# EAGLE design atmega32u4bb_ASDF (EAGLE 6.4)
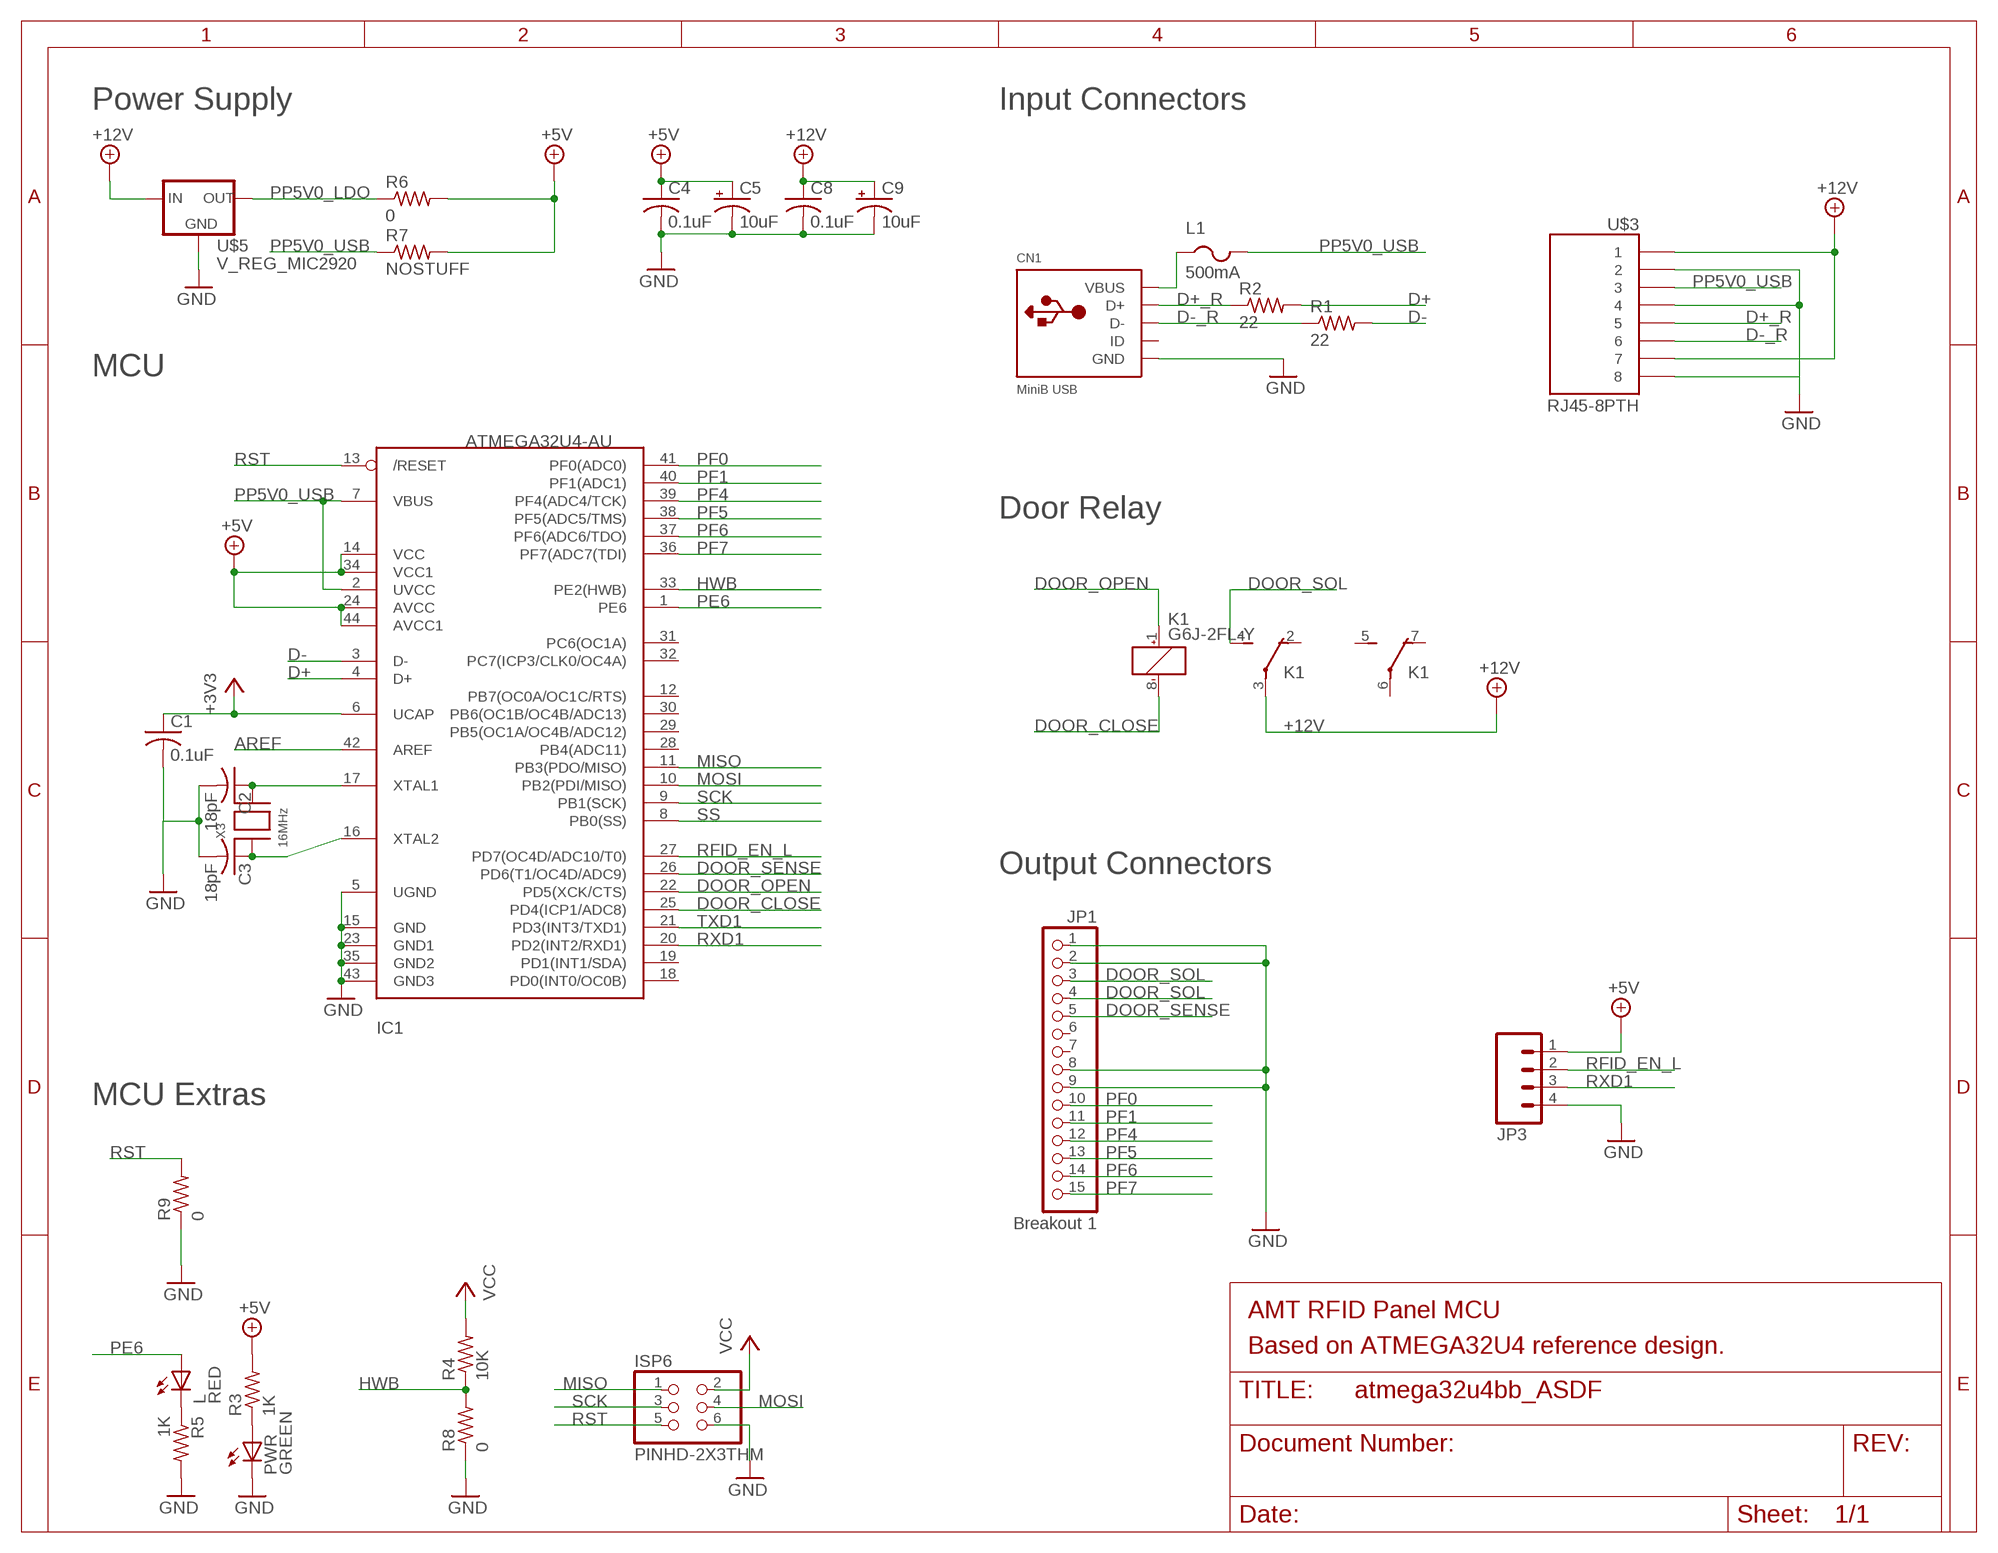
[diagram p0: schematic, sheet 1]

## Parts
C1  0.1uF  C-USC0805K  [C0805K]
C2  18pF  C-USC0805K  [C0805K]
C3  18pF  C-USC0805K  [C0805K]
C4  0.1uF  C-USC0805K  [C0805K]
C5  10uF  CPOL-USA/3216-18R  [A/3216-18R]
C8  0.1uF  C-USC0805K  [C0805K]
C9  10uF  CPOL-USA/3216-18R  [A/3216-18R]
CN1  MiniB USB  USBMINIB  [USB-MINIB]
IC1  ATMEGA32U4-AU  [TQFP44]
ISP6  PINHD-2X3THM  [ISP6]
JP1  Breakout 1  PINHD-1X15-CB  [1X15-CB]
JP3  M04LOCK  [1X04_LOCK]
K1  G6J-2FL-Y  [G6J-2FL-Y]
L  RED  LEDCHIPLED_0805  [CHIPLED_0805]
L1  500mA  PTCFUSE-1206  [R1206]
PWR  GREEN  LEDCHIPLED_0805  [CHIPLED_0805]
R1  22  R-US_R0805  [R0805]
R2  22  R-US_R0805  [R0805]
R3  1K  R-US_R0805  [R0805]
R4  10K  R-US_R0805  [R0805]
R5  1K  R-US_R0805  [R0805]
R6  0  R-US_R0805  [R0805]
R7  NOSTUFF  R-US_R0805  [R0805]
R8  0  R-US_R0805  [R0805]
R9  0  R-US_R0805  [R0805]
U$3  RJ45-8PTH  [RJ45-8]
U$5  V_REG_MIC2920  [SOT223]
X3  16MHz  XTALNX5032  [NX5032]

## Nets
+3V3: C1.1 IC1.6(UCAP)
+5V: C4.1 C5.+ IC1.14(VCC) IC1.24(AVCC) IC1.34(VCC1) IC1.44(AVCC1) JP3.1 R3.2 R6.2 R7.2
+12V: C8.1 C9.+ K1.3(2:P) U$3.1 U$3.7 U$5.1(IN)
AREF: IC1.42(AREF)
D+: IC1.4(D+) R2.2
D+_R: CN1.D+ R2.1 U$3.5
D-: IC1.3(D-) R1.2
D-_R: CN1.D- R1.1 U$3.6
DOOR_CLOSE: IC1.25(PD4(ICP1/ADC8)) K1.8(1:-)
DOOR_OPEN: IC1.22(PD5(XCK/CTS)) K1.1(1:+)
DOOR_SENSE: IC1.26(PD6(T1/OC4D/ADC9)) JP1.5
DOOR_SOL: JP1.3 JP1.4 K1.4(2:S)
GND: C1.2 C2.2 C3.2 C4.2 C5.- C8.2 C9.- CN1.GND IC1.5(UGND) IC1.15(GND) IC1.23(GND1) IC1.35(GND2) IC1.43(GND3) ISP6.6 JP1.1 JP1.2 JP1.8 JP1.9 JP3.4 PWR.C R5.2 R8.1 R9.1 U$3.2 U$3.4 U$3.8 U$5.2(GND)
HWB: IC1.33(PE2(HWB)) R4.1 R8.2
MISO: IC1.11(PB3(PDO/MISO)) ISP6.1
MOSI: IC1.10(PB2(PDI/MISO)) ISP6.4
N$1: PWR.A R3.1
N$8: C2.1 IC1.17(XTAL1) X3.P$2
N$9: C3.1 IC1.16(XTAL2) X3.P$1
N$10: L.C R5.1
PE6: IC1.1(PE6) L.A
PF0: IC1.41(PF0(ADC0)) JP1.10
PF1: IC1.40(PF1(ADC1)) JP1.11
PF4: IC1.39(PF4(ADC4/TCK)) JP1.12
PF5: IC1.38(PF5(ADC5/TMS)) JP1.13
PF6: IC1.37(PF6(ADC6/TDO)) JP1.14
PF7: IC1.36(PF7(ADC7(TDI)) JP1.15
PP5V0_LDO: R6.1 U$5.3(OUT)
PP5V0_USB: IC1.2(UVCC) IC1.7(VBUS) L1.2 R7.1 U$3.3
RFID_EN_L: IC1.27(PD7(OC4D/ADC10/T0)) JP3.2
RST: IC1.13(/RESET) ISP6.5 R9.2
RXD1: IC1.20(PD2(INT2/RXD1)) JP3.3
SCK: IC1.9(PB1(SCK)) ISP6.3
SS: IC1.8(PB0(SS))
TXD1: IC1.21(PD3(INT3/TXD1))
VBUS: CN1.VBUS L1.1
VCC: ISP6.2 R4.2
Unconnected: CN1.ID IC1.12(PB7(OC0A/OC1C/RTS)) IC1.18(PD0(INT0/OC0B)) IC1.19(PD1(INT1/SDA)) IC1.28(PB4(ADC11)) IC1.29(PB5(OC1A/OC4B/ADC12)) IC1.30(PB6(OC1B/OC4B/ADC13)) IC1.31(PC6(OC1A)) IC1.32(PC7(ICP3/CLK0/OC4A)) JP1.6 JP1.7 K1.2(2:O) K1.5(3:S) K1.6(3:P) K1.7(3:O)

## Notes on the sheet
- Power Supply | Input Connectors
- MCU
- Door Relay
- Output Connectors
- MCU Extras
- AMT RFID Panel MCU
- Based on ATMEGA32U4 reference design.

## Library data of the parts
C1-C4 C8 = adafruit:C-US: CAPACITOR, American symbol
C5 C9 = adafruit:CPOL-US: POLARIZED CAPACITOR, American symbol
CN1 = adafruit:USB: USB Connectors USBMINIB - Surface Mount Female Mini-B USB Connector 4UConnector: 06564 By microbuilder.eu Thru-hole RA Female Mini-B USB Connector 4UConnector: 18732 By ladyada.net
IC1 = adaprog:ATMEGA32U4
ISP6 = adaprog:PINHD-2X3
JP1 = adafruit:PINHD-1X15: PIN HEADER
JP3 = SparkFun-Connectors:M04: Header 4 Standard 4-pin 0.1" header. Use with straight break away headers (SKU : PRT-00116), right angle break away headers (PRT-00553), swiss pins (PRT-00743), machine pins (PRT-00117), and female headers (PRT-00115). Molex polarized connector foot print use with SKU : PRT-08231 with associated crimp pins and housings. 1MM SMD Version SKU: PRT-10208
K1 = relay:G6J*-2?-Y: Surface-Mounting Signal Relay - G6J-Y 5.7 x 10.6 x 9 mm Source: http://www.omroncomponents.eu/ .. K125-E2-02-X.pdf; MPN: G6J-2FL-Y-TR DC4.5; OC_FARNELL: 1798618; OC_NEWARK: 04M9907
L PWR = adafruit:LED: LED OSRAM: - CHIPLED LG R971, LG N971, LY N971, LG Q971, LY Q971, LO R971, LY R971 LH N974, LH R974 LS Q976, LO Q976, LY Q976 LO Q996 - Hyper CHIPLED LW Q18S LB Q993, LB Q99A, LB R99A - SideLED LS A670, LO A670, LY A670, LG A670, LP A670 LB A673, LV A673, LT A673, LW A673 LH A674 LY A675 LS A676, LA A676, LO A676, LY A676, LW A676 LS A679, LY A679, LG A679 - Hyper Micro SIDELED® LS Y876, LA Y876, LO Y876, LY Y876 LT Y87S - SmartLED LW L88C, LW L88S LB L89C, LB L89S, LG L890 LS L89K, LO L89K, LY L89K LS L896, LA L896, LO L896, LY L896 - TOPLED LS T670, LO T670, LY T670, LG T670, LP T670 LSG T670, LSP T670, LSY T670, LOP T670, LYG T670 LG T671, LOG T671, LSG T671 LB T673, LV T673, LT T673, LW T673 LH T674 LS T676, LA T676, LO T676, LY T676, LB T676, LH T676, LSB T676, LW T676 LB T67C, LV T67C, LT T67C, LS T67K, LO T67K, LY T67K, LW E67C LS E67B, LA E67B, LO E67B, LY E67B, LB E67C, LV E67C, LT E67C LW T67C LS T679, LY T679, LG T679 LS T770, LO T770, LY T770, LG T770, LP T770 LB T773, LV T773, LT T773, LW T773 LH T774 LS E675, LA E675, LY E675, LS T675 LS T776, LA T776, LO T776, LY T776, LB T776 LHGB T686 LT T68C, LB T68C - Hyper Mini TOPLED® LB M676 - Mini TOPLED Santana® LG M470 LS M47K, LO M47K, LY M47K Source: http://www.osram.convergy.de/
L1 = adafruit:PTCFUSE: PTC fuses, resettable thermistors
R1-R9 = adafruit:R-US_: RESISTOR, American symbol
U$3 = SparkFun-Connectors:RJ45-8: RJ45 Jack Simple RJ45, 8-pin connection - connector for common Cat5, Cat5e, and Cat6 Ethernet cables. Footprint not yet proven in production. Connector sku is PRT-00643; Breakout PCB sku is BOB-00716.
U$5 = SparkFun-PowerIC:V_REG_MIC2920: MIC2920A (http://www.micrel.com/_PDF/mic2920.pdf) - 400mA output LDO Regulator
X3 = adaprog:XTAL

## Board
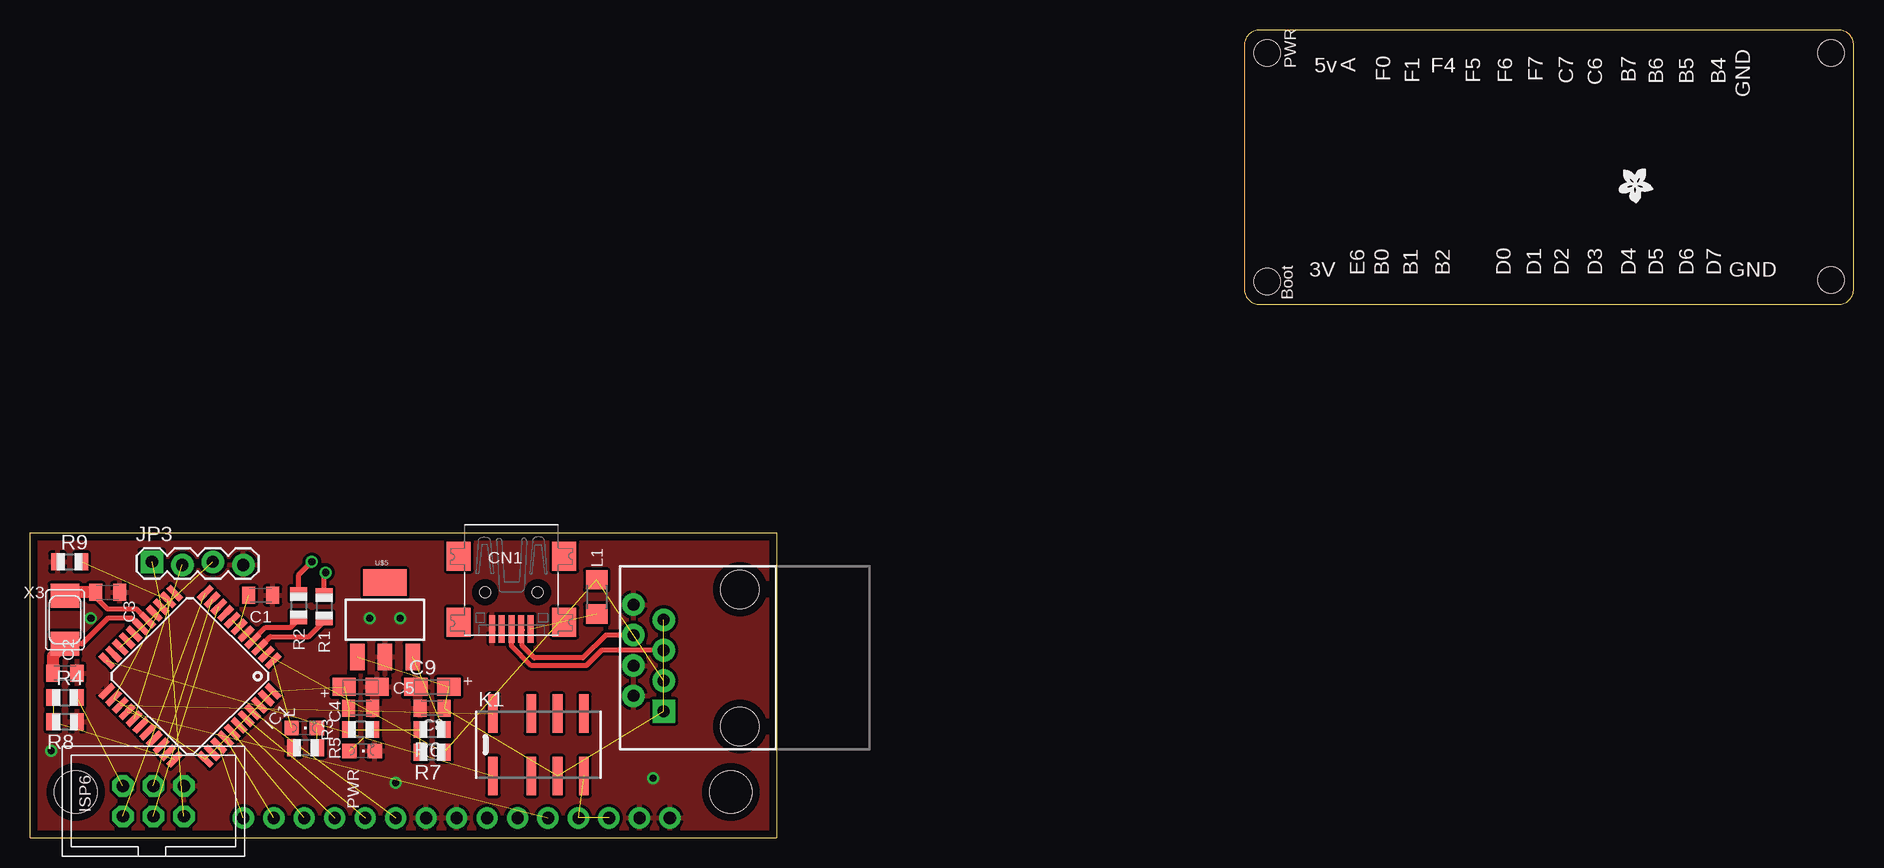
[diagram p1: board, top side]
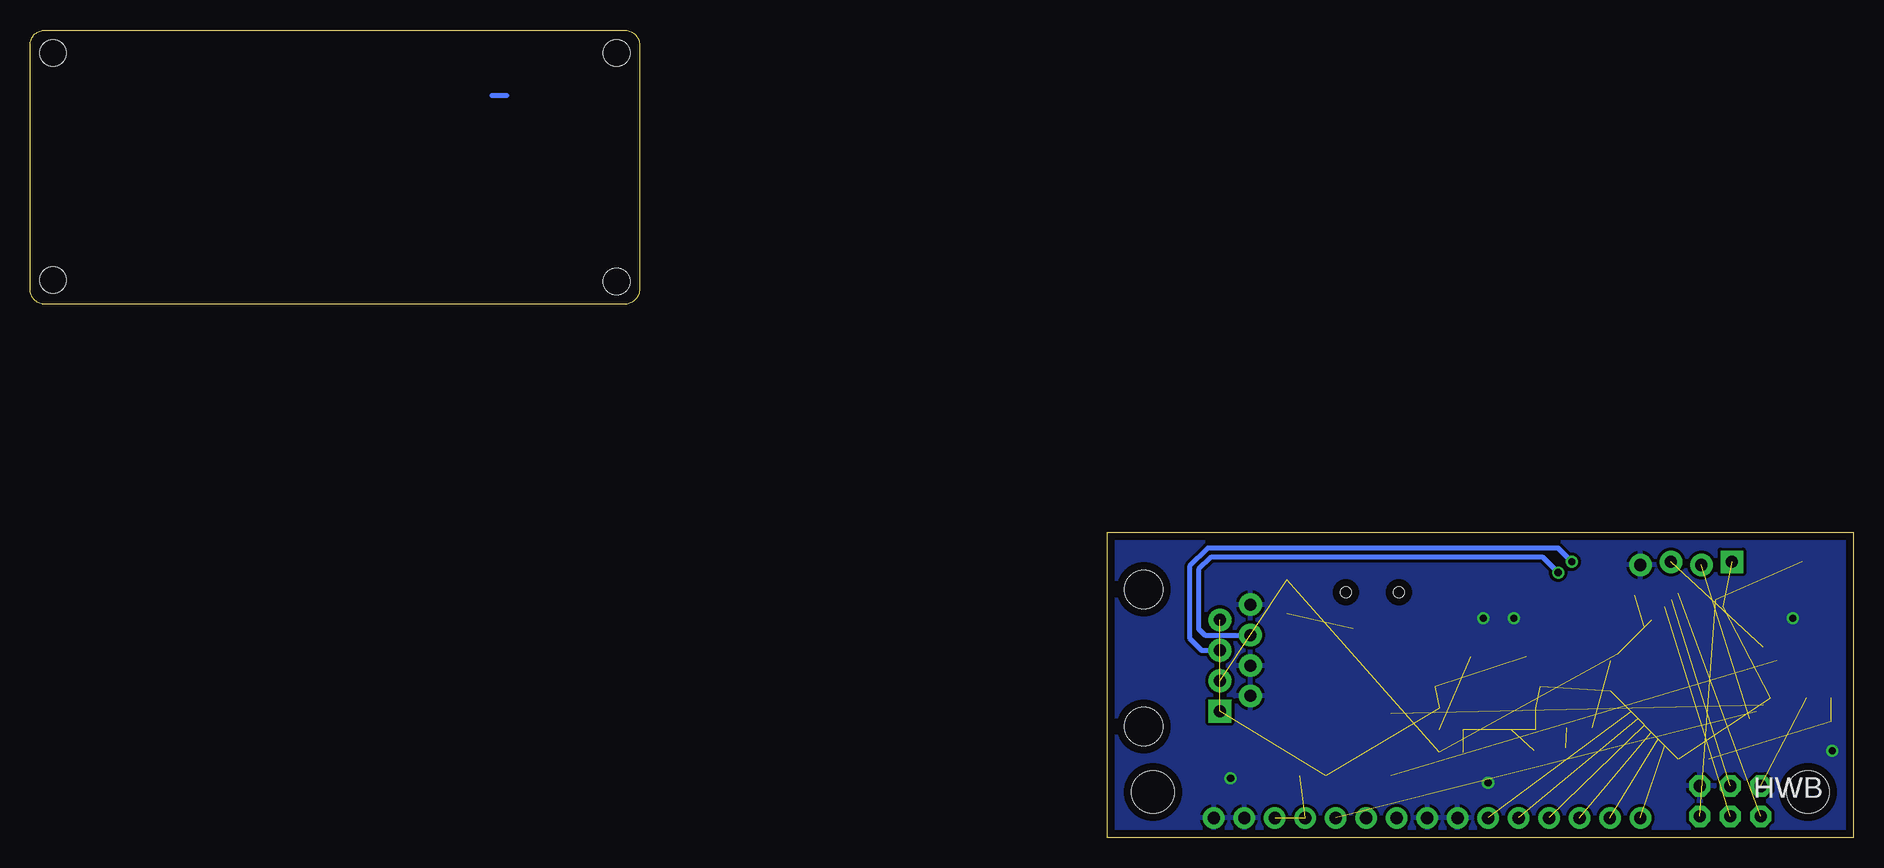
[diagram p2: board, bottom side, seen from below]

Size 152.02 x 67.31 mm. Coordinates in mm from the lower left corner, seen from the top.
Outline: 102.49,67.31 arc90 101.22,66.04 101.22,45.72 arc90 102.49,44.45 150.75,44.45 arc90 152.02,45.72 152.02,66.04 arc90 150.75,67.31 102.49,67.31
Outline: 0,0 0,25.4 62.23,25.4 62.23,0 0,0
Copper layers (1*16): Top 0.035mm / dielectric 1.5mm / Bottom 0.035mm
Design rules "default *": minimum track width 10mil, minimum drill 19mil, track to track 10mil, track to pad 10mil, pad to pad 10mil, via to via 10mil, smd to smd 0mil, copper to edge 25mil, drill to drill 8mil, minimum pad ring 10mil, minimum via ring 8mil, stop-mask expansion 4mil, vias tented up to drill 20mil, thermal gap 10mil
Holes 2.2 mm at 103.12,65.41 103.12,46.35 150.11,65.41 150.11,46.48
Holes 3.56 mm at 3.81,3.81 58.42,3.81

### Footprints (pad centres in the part's own frame; a part is rotated, then mirrored left to right if it is on the bottom)
C0805K = smd 1.1 x 1.4: 1 -1,0; 2 1,0
A/3216-18R = smd 1.95 x 1.5: + 1.375,0; - -1.375,0
USB-MINIB = smd 0.5 x 2.308: D+ 0,4.064; D- -0.8,4.064; GND 1.6,4.064; ID 0.8,4.064; VBUS -1.6,4.064 | smd 2 x 2.4: GND1 -4.4,-2; GND2 -4.4,3.5; GND3 4.4,3.5; GND4 4.4,-2 | hole 0.9: -2.2,1; 2.2,1
TQFP44 = smd 1.5 x 0.5: 1 -5.8,4; 2 -5.8,3.2; 3 -5.8,2.4; 4 -5.8,1.6; 5 -5.8,0.8; 6 -5.8,0; 7 -5.8,-0.8; 8 -5.8,-1.6; 9 -5.8,-2.4; 10 -5.8,-3.2; 11 -5.8,-4; 23 5.8,-4; 24 5.8,-3.2; 25 5.8,-2.4; 26 5.8,-1.6; 27 5.8,-0.8; 28 5.8,0; 29 5.8,0.8; 30 5.8,1.6; 31 5.8,2.4; 32 5.8,3.2; 33 5.8,4 | smd 0.5 x 1.5: 12 -4,-5.8; 13 -3.2,-5.8; 14 -2.4,-5.8; 15 -1.6,-5.8; 16 -0.8,-5.8; 17 0,-5.8; 18 0.8,-5.8; 19 1.6,-5.8; 20 2.4,-5.8; 21 3.2,-5.8; 22 4,-5.8; 34 4,5.8; 35 3.2,5.8; 36 2.4,5.8; 37 1.6,5.8; 38 0.8,5.8; 39 0,5.8; 40 -0.8,5.8; 41 -1.6,5.8; 42 -2.4,5.8; 43 -3.2,5.8; 44 -4,5.8
ISP6 = drill 1.016 pad 1.778 octagon: 1 -2.54,-1.27; 2 -2.54,1.27; 3 0,-1.27; 4 0,1.27; 5 2.54,-1.27; 6 2.54,1.27
1X15-CB = drill 1.016 pad 1.778: 1 -17.78,0; 2 -15.24,0; 3 -12.7,0; 4 -10.16,0; 5 -7.62,0; 6 -5.08,0; 7 -2.54,0; 8 0,0; 9 2.54,0; 10 5.08,0; 11 7.62,0; 12 10.16,0; 13 12.7,0; 14 15.24,0; 15 17.78,0
1X04_LOCK = drill 1.016 pad 1.88 square: 1 0,0.127 | drill 1.016 pad 1.88: 2 2.54,-0.127; 3 5.08,0.127; 4 7.62,-0.127
G6J-2FL-Y = smd 0.8 x 3.2: 1 -3.2,-2.6; 2 0,-2.6; 3 2.2,-2.6; 4 4.4,-2.6; 5 4.4,2.6; 6 2.2,2.6; 7 0,2.6; 8 -3.2,2.6
CHIPLED_0805 = smd 1.2 x 1.2: A 0,-1.05; C 0,1.05
R1206 = smd 1.6 x 1.803: 1 -1.422,0; 2 1.422,0
R0805 = smd 1.1 x 1.4: 1 -1,0; 2 1,0
RJ45-8 = drill 1 pad 1.88 square: 1 -4.445,6.35 | drill 1 pad 1.88: 2 -3.175,8.89; 3 -1.905,6.35; 4 -0.635,8.89; 5 0.635,6.35; 6 1.905,8.89; 7 3.175,6.35; 8 4.445,8.89 | hole 3.2: -5.715,0; 5.715,0
SOT223 = smd 1.219 x 2.235: 1 -2.311,-3.099; 2 0,-3.099; 3 2.311,-3.099 | smd 3.6 x 2.2: 4 0,3.099
NX5032 = smd 2 x 2.4: P$1 2,0; P$2 -2,0

### Placement (x,y rotation side)
C1  19.24,20.21 0 top
C2  2.92,13.72 0 top
C3  6.48,20.45 0 top
C4  27.56,10.79 0 top
C5  27.56,12.57 180 top
C8  33.53,10.79 180 top
C9  33.53,12.57 0 top
CN1  40.13,21.46 180 top
IC1  13.34,13.46 225 top
ISP6  10.29,3.05 0 top
JP1  35.56,1.65 180 top
JP3  10.16,22.86 0 top
K1  41.78,7.75 0 top
L  22.86,9.14 270 top
L1  47.24,20.07 90 top
PWR  27.69,7.24 270 top
R1  24.51,19.25 270 top
R2  22.4,19.33 270 top
R3  27.56,9.02 180 top
R4  2.92,11.68 0 top
R5  22.99,7.49 180 top
R6  33.53,9.02 180 top
R7  33.53,7.11 180 top
R8  2.92,9.65 180 top
R9  3.3,22.99 0 top
U$3  59.18,14.99 90 top
U$4  [ADAFRUIT200MIL]  133.99,54.36 180 top
U$5  29.59,18.16 0 top
X3  2.92,18.16 90 top

### Tracks (layer width: path | path; a pad name or v marks a point on that pad's centre or on a via)
+3V3  (1 unrouted)
+5V  (9 unrouted)
+12V  (5 unrouted)
D+
  Top 0.406: IC1.4 19.66,17.53 21.72,17.53 22.41,18.21 R2.2
D+_R  (via drill 0.6)
  Top 0.406: U$3.5 47.62,15.62 46.35,14.35 41.78,14.35 40.13,16 CN1.D+ | R2.1 22.41,21.9 v23.5,22.99
  Bottom 0.406: v23.5,22.99 24.64,24.13 53.85,24.13 55.37,22.61 55.37,16.64 54.36,15.62 U$3.5
D-
  Top 0.406: IC1.3 20.03,16.76 23.24,16.76 24.51,18.03 R1.2
D-_R  (via drill 0.6)
  Top 0.406: U$3.6 48.01,16.89 46.1,14.99 42.04,14.99 41.02,16 41.02,17.31 CN1.D- | R1.1 24.51,21.97 v24.64,22.1
  Bottom 0.406: v24.64,22.1 25.91,23.37 53.59,23.37 54.61,22.35 54.61,17.4 54.1,16.89 U$3.6
DOOR_CLOSE  (1 unrouted)
DOOR_OPEN  (1 unrouted)
DOOR_SENSE  (1 unrouted)
DOOR_SOL  (2 unrouted)
GND  (via drill 0.6)
  other vias: 5.08,18.29 1.78,7.24 30.48,4.57 51.94,4.95 28.32,18.29 30.86,18.29
  pour Bottom: 0,0 0,38.1 62.23,38.1 62.23,0
  pour Top: 0,0 0,25.4 62.23,25.4 62.23,0
HWB  (2 unrouted)
MISO  (1 unrouted)
MOSI  (1 unrouted)
N$1  (1 unrouted)
N$6
  Bottom 0.406: 112.27,61.85 113.54,61.85
N$8
  Top 0.406: IC1.17 8.51,18.29 6.48,18.29 4.35,16.16 X3.P$2
  Top 1.016: C2.1 1.92,15.16 X3.P$2
N$9
  Top 0.406: IC1.16 8.88,19.05 6.48,19.05 5.48,20.05 C3.1
  Top 1.016: C3.1 3.21,20.45 X3.P$1
N$10  (1 unrouted)
PE6  (1 unrouted)
PF0  (1 unrouted)
PF1  (1 unrouted)
PF4  (1 unrouted)
PF5  (1 unrouted)
PF6  (1 unrouted)
PF7  (1 unrouted)
PP5V0_LDO  (1 unrouted)
PP5V0_USB  (4 unrouted)
RFID_EN_L  (1 unrouted)
RST  (2 unrouted)
RXD1  (1 unrouted)
SCK  (1 unrouted)
VBUS  (1 unrouted)
VCC  (1 unrouted)

### Text on the board
tPlace: 5v | A | F0 | F1 | F5 | F6 | F7 | C7 | C6 | B7 | B6 | B5 | B4 | PWR | F4 | GND | 3V | E6 | B0 | B1 | B2 | D0 | D1 | D2 | D3 | D4 | D5 | D6 | D7 | GND | Boot
bPlace: from adafruit! | Vcc | HWB | Atmega32u4 Breakout Board+